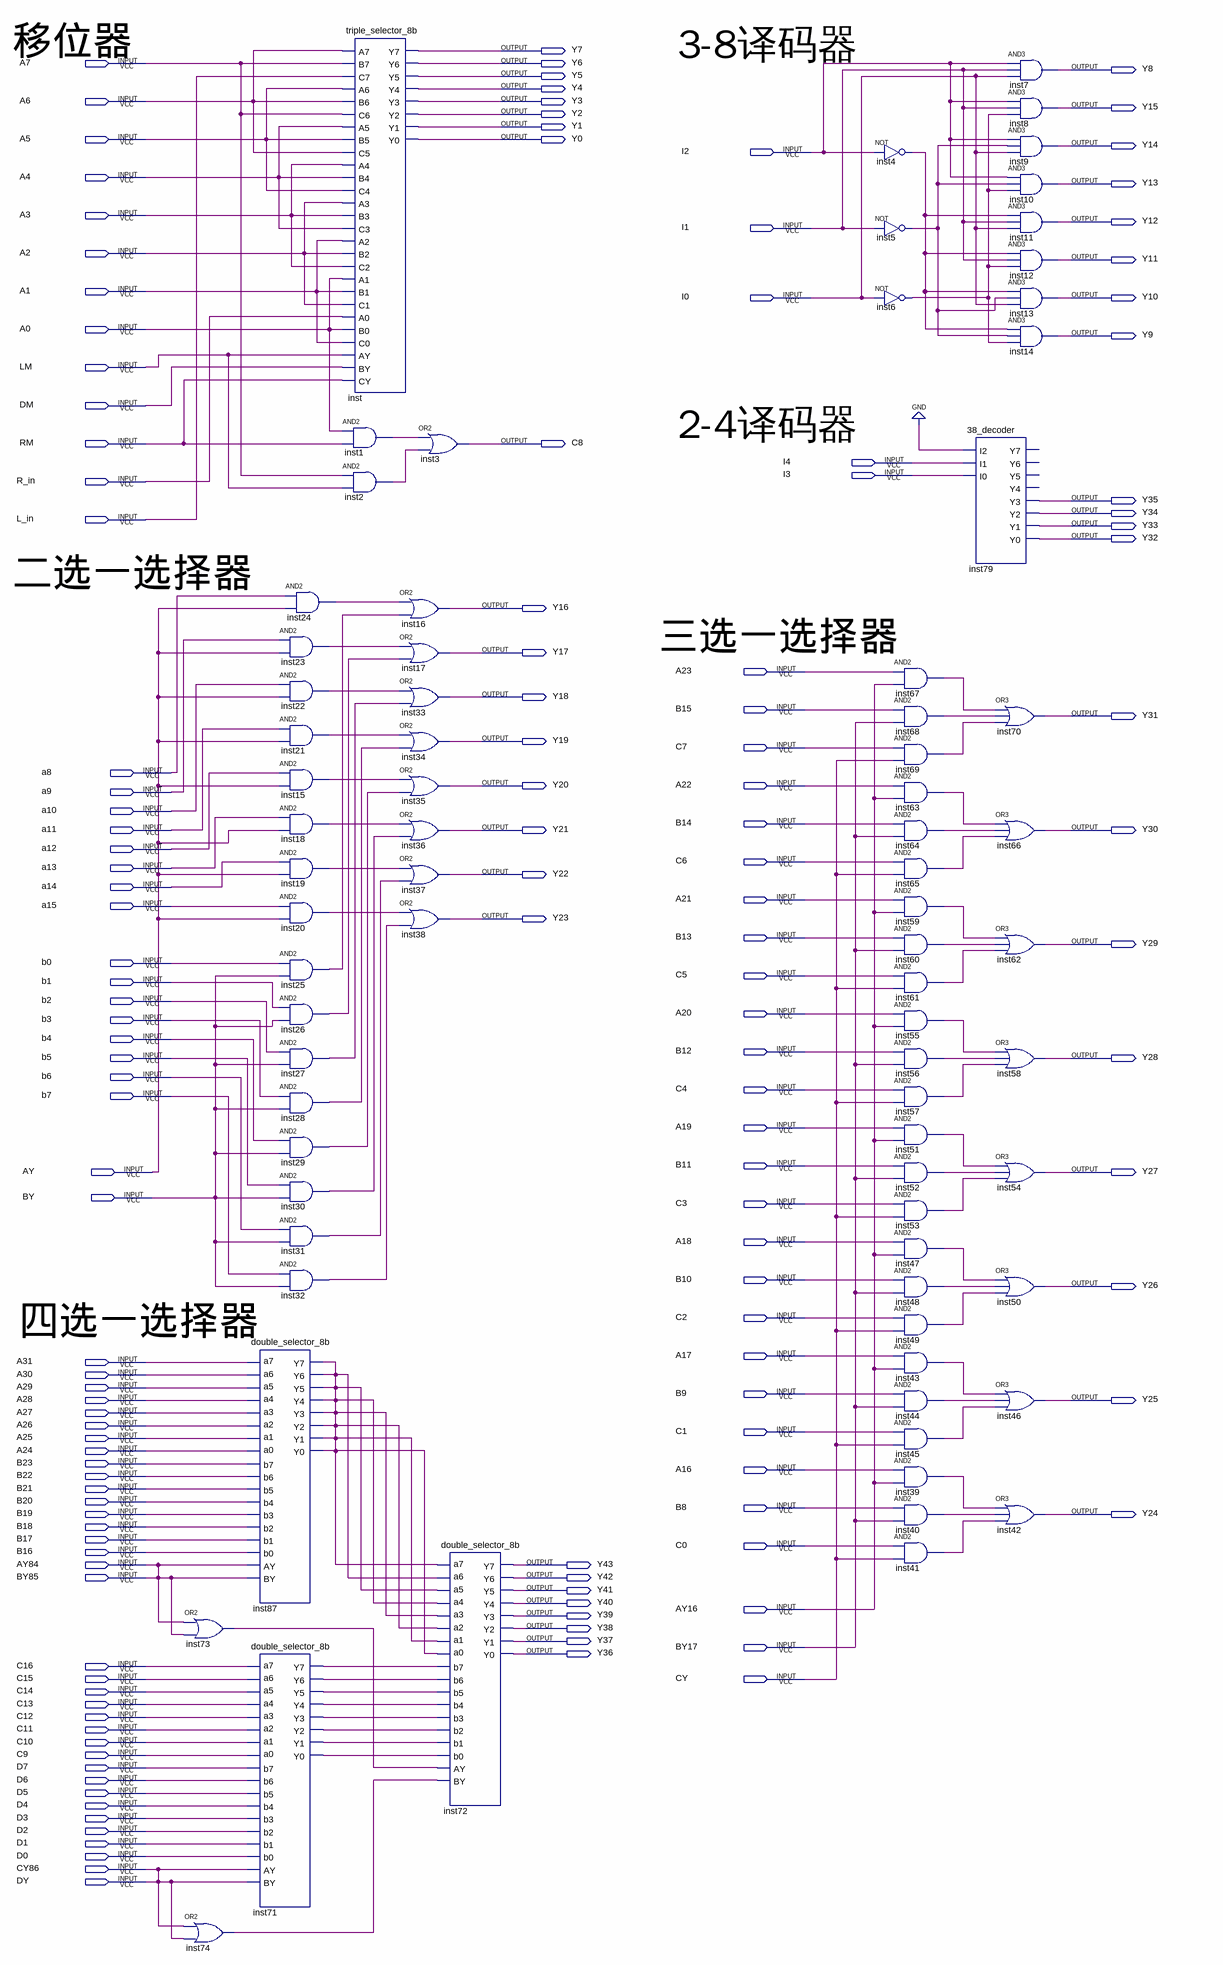
[diagram p0: schematic sheet]
// Quartus schematic print4.bdf as structural Verilog: 77 symbols, 144 pins
module print4 (
  input  A7,
  input  A6,
  input  A5,
  input  I2,
  input  A4,
  input  A3,
  input  I1,
  input  A2,
  input  A1,
  input  I0,
  input  A0,
  input  LM,
  input  DM,
  input  RM,
  input  I4,
  input  I3,
  input  R_in,
  input  L_in,
  input  A23,
  input  B15,
  input  C7,
  input  a8,
  input  A22,
  input  a9,
  input  a10,
  input  B14,
  input  a11,
  input  a12,
  input  C6,
  input  a13,
  input  a14,
  input  A21,
  input  a15,
  input  B13,
  input  b0,
  input  C5,
  input  b1,
  input  b2,
  input  A20,
  input  b3,
  input  b4,
  input  B12,
  input  b5,
  input  b6,
  input  C4,
  input  b7,
  input  A19,
  input  B11,
  input  AY,
  input  BY,
  input  C3,
  input  A18,
  input  B10,
  input  C2,
  input  A17,
  input  A31,
  input  A30,
  input  A29,
  input  B9,
  input  A28,
  input  A27,
  input  A26,
  input  C1,
  input  A25,
  input  A24,
  input  B23,
  input  A16,
  input  B22,
  input  B21,
  input  B20,
  input  B8,
  input  B19,
  input  B18,
  input  B17,
  input  C0,
  input  B16,
  input  AY84,
  input  BY85,
  input  AY16,
  input  BY17,
  input  C16,
  input  C15,
  input  CY,
  input  C14,
  input  C13,
  input  C12,
  input  C11,
  input  C10,
  input  C9,
  input  D7,
  input  D6,
  input  D5,
  input  D4,
  input  D3,
  input  D2,
  input  D1,
  input  D0,
  input  CY86,
  input  DY,
  output Y7,
  output Y6,
  output Y8,
  output Y5,
  output Y4,
  output Y3,
  output Y15,
  output Y2,
  output Y1,
  output Y0,
  output Y14,
  output Y13,
  output Y12,
  output Y11,
  output Y10,
  output Y9,
  output C8,
  output Y35,
  output Y34,
  output Y33,
  output Y32,
  output Y16,
  output Y17,
  output Y18,
  output Y31,
  output Y19,
  output Y20,
  output Y21,
  output Y30,
  output Y22,
  output Y23,
  output Y29,
  output Y28,
  output Y27,
  output Y26,
  output Y25,
  output Y24,
  output Y43,
  output Y42,
  output Y41,
  output Y40,
  output Y39,
  output Y38,
  output Y37,
  output Y36
);

  wire inst1_out, inst2_out, inst4_out, inst5_out, inst6_out, inst15_out, inst18_out, inst19_out, inst20_out,
       inst21_out, inst22_out, inst23_out, inst24_out, inst25_out, inst26_out, inst27_out, inst28_out,
       inst29_out, inst30_out, inst31_out, inst32_out, inst39_out, inst40_out, inst41_out, inst43_out,
       inst44_out, inst45_out, inst47_out, inst48_out, inst49_out, inst51_out, inst52_out, inst53_out,
       inst55_out, inst56_out, inst57_out, inst59_out, inst60_out, inst61_out, inst63_out, inst64_out,
       inst65_out, inst67_out, inst68_out, inst69_out, inst71_y0, inst71_y1, inst71_y2, inst71_y3, inst71_y4,
       inst71_y5, inst71_y6, inst71_y7, inst73_out, inst74_out, inst87_y0;

  or inst73 (inst73_out, AY84, AY84);
  or inst74 (inst74_out, CY86, CY86);
  and inst24 (inst24_out, a8, AY);
  and inst23 (inst23_out, a9, AY);
  and inst22 (inst22_out, a10, AY);
  and inst21 (inst21_out, a11, AY);
  and inst15 (inst15_out, a12, AY);
  and inst18 (inst18_out, a13, AY);
  and inst19 (inst19_out, a14, AY);
  and inst20 (inst20_out, a15, AY);
  and inst25 (inst25_out, b0, BY);
  and inst26 (inst26_out, b1, BY);
  and inst27 (inst27_out, b2, BY);
  and inst28 (inst28_out, b3, BY);
  and inst29 (inst29_out, b4, BY);
  and inst30 (inst30_out, b5, BY);
  and inst31 (inst31_out, b6, BY);
  and inst32 (inst32_out, b7, BY);
  double_selector_8b inst87 (
    .a0(A24), .a1(A25), .a2(A26), .a3(A27), .a4(A28), .a5(A29), .a6(A30), .a7(A31), .b0(B16), .b1(B17),
    .b2(B18), .b3(B19), .b4(B20), .b5(B21), .b6(B22), .b7(B23), .AY(AY84), .BY(AY84), .Y0(inst87_y0),
    .Y1(inst87_y0), .Y2(inst87_y0), .Y3(inst87_y0), .Y4(inst87_y0), .Y5(inst87_y0), .Y6(inst87_y0),
    .Y7(inst87_y0));
  double_selector_8b inst71 (
    .a0(C9), .a1(C10), .a2(C11), .a3(C12), .a4(C13), .a5(C14), .a6(C15), .a7(C16), .b0(D0), .b1(D1), .b2(D2),
    .b3(D3), .b4(D4), .b5(D5), .b6(D6), .b7(D7), .AY(CY86), .BY(CY86), .Y0(inst71_y0), .Y1(inst71_y1),
    .Y2(inst71_y2), .Y3(inst71_y3), .Y4(inst71_y4), .Y5(inst71_y5), .Y6(inst71_y6), .Y7(inst71_y7));
  triple_selector_8b inst (
    .A7(A6), .B7(A7), .C7(L_in), .A6(A5), .B6(A6), .C6(A7), .A5(A4), .B5(A5), .C5(A6), .A4(A3), .B4(A4),
    .C4(A5), .A3(A2), .B3(A3), .C3(A4), .A2(A1), .B2(A2), .C2(A3), .A1(A0), .B1(A1), .C1(A2), .A0(R_in),
    .B0(A0), .C0(A1), .AY(LM), .BY(DM), .CY(RM), .Y7(Y7), .Y6(Y6), .Y5(Y5), .Y4(Y4), .Y3(Y3), .Y2(Y2),
    .Y1(Y1), .Y0(Y0));
  and inst1 (inst1_out, A0, RM);
  and inst2 (inst2_out, A7, LM);
  or inst3 (C8, inst1_out, inst2_out);
  or inst16 (Y16, inst24_out, inst25_out);
  or inst17 (Y17, inst23_out, inst26_out);
  or inst33 (Y18, inst22_out, inst27_out);
  or inst34 (Y19, inst21_out, inst28_out);
  or inst35 (Y20, inst15_out, inst29_out);
  or inst36 (Y21, inst18_out, inst30_out);
  or inst37 (Y22, inst19_out, inst31_out);
  or inst38 (Y23, inst20_out, inst32_out);
  double_selector_8b inst72 (
    .a0(inst87_y0), .a1(inst87_y0), .a2(inst87_y0), .a3(inst87_y0), .a4(inst87_y0), .a5(inst87_y0),
    .a6(inst87_y0), .a7(inst87_y0), .b0(inst71_y0), .b1(inst71_y1), .b2(inst71_y2), .b3(inst71_y3),
    .b4(inst71_y4), .b5(inst71_y5), .b6(inst71_y6), .b7(inst71_y7), .AY(inst73_out), .BY(inst74_out),
    .Y0(Y36), .Y1(Y37), .Y2(Y38), .Y3(Y39), .Y4(Y40), .Y5(Y41), .Y6(Y42), .Y7(Y43));
  not inst4 (inst4_out, I2);
  not inst5 (inst5_out, I1);
  not inst6 (inst6_out, I0);
  and inst67 (inst67_out, A23, AY16);
  and inst68 (inst68_out, B15, BY17);
  and inst69 (inst69_out, C7, CY);
  and inst63 (inst63_out, A22, AY16);
  and inst64 (inst64_out, B14, BY17);
  and inst65 (inst65_out, C6, CY);
  and inst59 (inst59_out, A21, AY16);
  and inst60 (inst60_out, B13, BY17);
  and inst61 (inst61_out, C5, CY);
  and inst55 (inst55_out, A20, AY16);
  and inst56 (inst56_out, B12, BY17);
  and inst57 (inst57_out, C4, CY);
  and inst51 (inst51_out, A19, AY16);
  and inst52 (inst52_out, B11, BY17);
  and inst53 (inst53_out, C3, CY);
  and inst47 (inst47_out, A18, AY16);
  and inst48 (inst48_out, B10, BY17);
  and inst49 (inst49_out, C2, CY);
  and inst43 (inst43_out, A17, AY16);
  and inst44 (inst44_out, B9, BY17);
  and inst45 (inst45_out, C1, CY);
  and inst39 (inst39_out, A16, AY16);
  and inst40 (inst40_out, B8, BY17);
  and inst41 (inst41_out, C0, CY);
  \38_decoder  inst79 (.I2(1'b0), .I1(I4), .I0(I3), .Y3(Y35), .Y2(Y34), .Y1(Y33), .Y0(Y32));  // open: Y7, Y6, Y5, Y4
  or inst70 (Y31, inst67_out, inst68_out, inst69_out);
  or inst66 (Y30, inst63_out, inst64_out, inst65_out);
  or inst62 (Y29, inst59_out, inst60_out, inst61_out);
  or inst58 (Y28, inst55_out, inst56_out, inst57_out);
  or inst54 (Y27, inst51_out, inst52_out, inst53_out);
  or inst50 (Y26, inst47_out, inst48_out, inst49_out);
  or inst46 (Y25, inst43_out, inst44_out, inst45_out);
  or inst42 (Y24, inst39_out, inst40_out, inst41_out);
  and inst7 (Y8, I2, I1, I0);
  and inst8 (Y15, I2, I1, inst6_out);
  and inst9 (Y14, I2, inst5_out, I0);
  and inst10 (Y13, I2, inst5_out, inst6_out);
  and inst11 (Y12, inst4_out, I1, I0);
  and inst12 (Y11, inst4_out, I1, inst6_out);
  and inst13 (Y10, inst4_out, inst5_out, I0);
  and inst14 (Y9, inst4_out, inst5_out, inst6_out);

  assign BY85 = AY84;
  assign DY = CY86;

  // Notes on the sheet:
  //   移位器
  //   3-8译码器
  //   2-4译码器
  //   二选一选择器
  //   三选一选择器
  //   四选一选择器
endmodule
